# Altium project Tester.PrjPcb
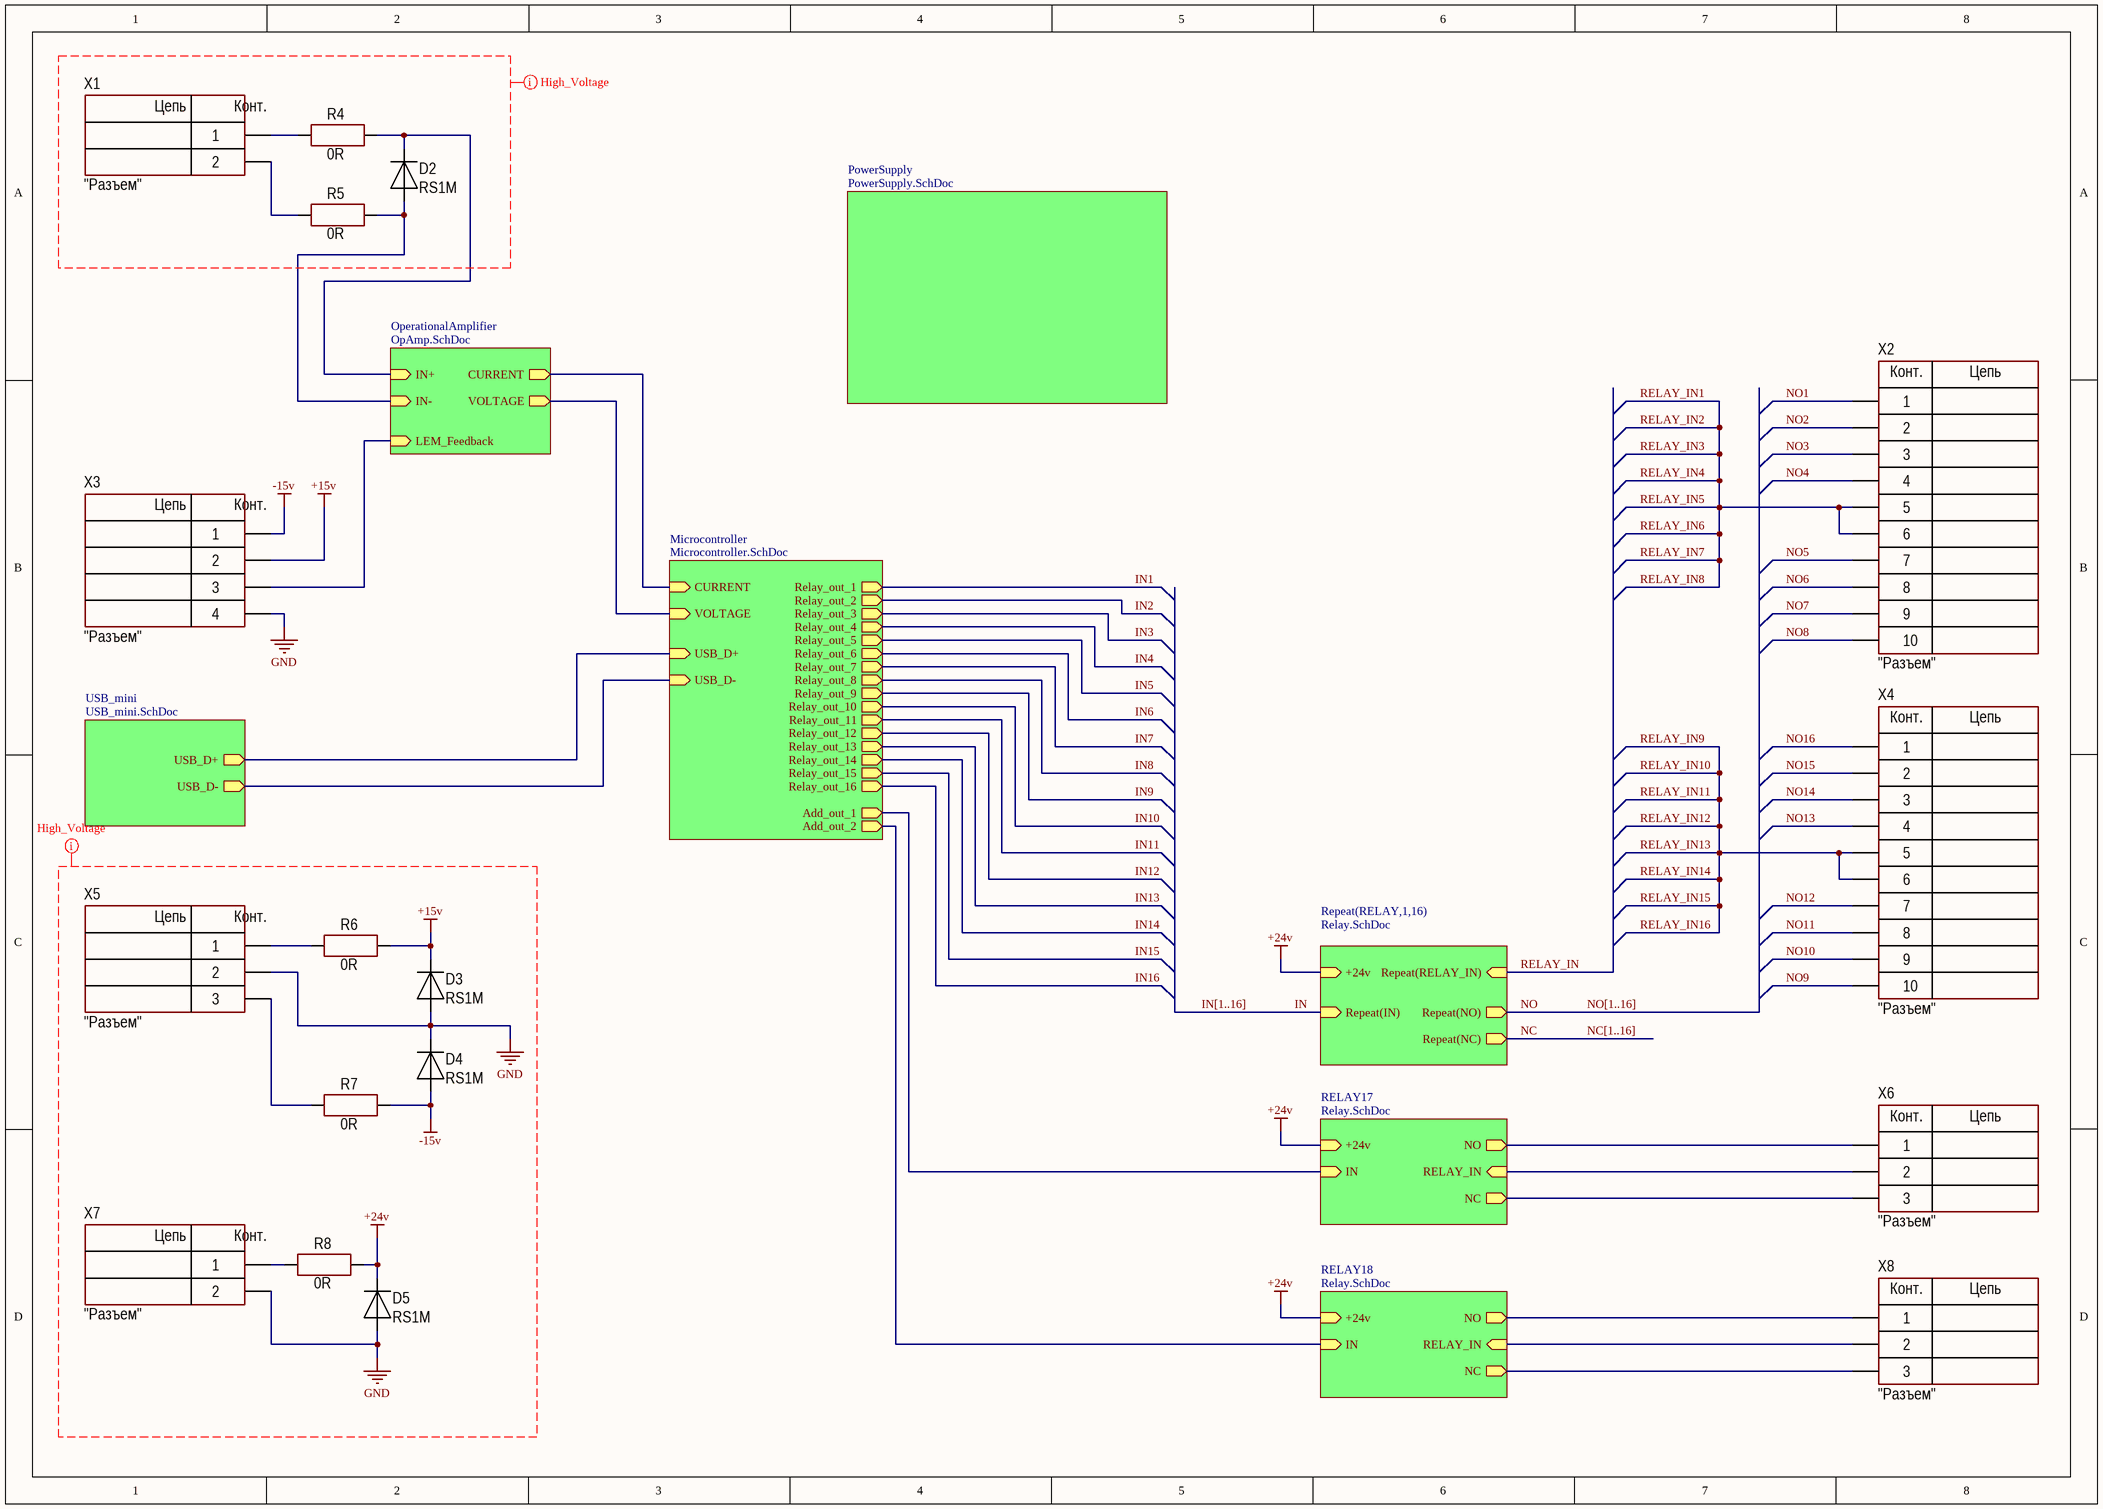
[diagram p0: Main.SchDoc]
6 sheets, 229 parts. Net scope: hierarchical (ports join the sheet entries above them; power ports are global).
Board file: PCB1.PcbDoc
Sheets:
  Main.SchDoc
    Microcontroller = Microcontroller.SchDoc
    USB_mini = USB_mini.SchDoc
    PowerSupply = PowerSupply.SchDoc
    OperationalAmplifier = OpAmp.SchDoc
    RELAY1 = Relay.SchDoc
    RELAY2 = Relay.SchDoc
    RELAY3 = Relay.SchDoc
    RELAY4 = Relay.SchDoc
    RELAY5 = Relay.SchDoc
    RELAY6 = Relay.SchDoc
    RELAY7 = Relay.SchDoc
    RELAY8 = Relay.SchDoc
    RELAY9 = Relay.SchDoc
    RELAY10 = Relay.SchDoc
    RELAY11 = Relay.SchDoc
    RELAY12 = Relay.SchDoc
    RELAY13 = Relay.SchDoc
    RELAY14 = Relay.SchDoc
    RELAY15 = Relay.SchDoc
    RELAY16 = Relay.SchDoc
    RELAY17 = Relay.SchDoc
    RELAY18 = Relay.SchDoc

## Sheet Main.SchDoc
size A3

### Parts
D2  PartNumber: RS1M  [DIODE: SMA]
D3  PartNumber: RS1M  [DIODE: SMA]
D4  PartNumber: RS1M  [DIODE: SMA]
D5  PartNumber: RS1M  [DIODE: SMA]
R4  value 0R  [RES: 1206]
R5  value 0R  [RES: 1206]
R6  value 0R  [RES: 1206]
R7  value 0R  [RES: 1206]
R8  value 0R  [RES: 1206]
X1  CommentText: "Разъем"  [300-021-12]
X2  CommentText: "Разъем"  [300-101-12]
X3  CommentText: "Разъем"  [300-041-12]
X4  CommentText: "Разъем"  [300-101-12]
X5  CommentText: "Разъем"  [300-031-12]
X6  CommentText: "Разъем"  [300-031-12]
X7  CommentText: "Разъем"  [300-021-12]
X8  CommentText: "Разъем"  [300-031-12]

### Sub-sheets
Microcontroller = Microcontroller.SchDoc: USB_D+ (in), USB_D- (in), VOLTAGE (in), CURRENT (in), Relay_out_10 (out), Relay_out_7 (out), Relay_out_14 (out), Relay_out_6 (out), Relay_out_3 (out), Relay_out_5 (out), Relay_out_11 (out), Relay_out_2 (out), Relay_out_12 (out), Relay_out_4 (out), Relay_out_1 (out), Relay_out_13 (out), Relay_out_8 (out), Relay_out_9 (out), Relay_out_16 (out), Relay_out_15 (out), Add_out_1 (out), Add_out_2 (out)
OperationalAmplifier = OpAmp.SchDoc: IN+ (in), LEM_Feedback (in), IN- (in), CURRENT (out), VOLTAGE (out)
PowerSupply = PowerSupply.SchDoc: no entries
RELAY17 = Relay.SchDoc: NC (out), IN (in), NO (out), RELAY_IN (in), +24v (in)
RELAY18 = Relay.SchDoc: +24v (in), NO (out), IN (in), RELAY_IN (in), NC (out)
Repeat(RELAY,1,16) = Relay.SchDoc: Repeat(IN) (in), +24v (in), Repeat(NO) (out), Repeat(RELAY_IN) (in), Repeat(NC) (out)
USB_mini = USB_mini.SchDoc: USB_D+ (out), USB_D- (out)

### Nets
+15v: D3.2 R6.1 X3.2
+24v: D5.2 R8.1 ; sheet Repeat(RELAY,1,16)/+24v, sheet RELAY17/+24v, sheet RELAY18/+24v
-15v: D4.1 R7.1 X3.1
GND: D3.1 D4.2 D5.1 X3.4 X5.2 X7.2
add_out1: sheet Microcontroller/Add_out_1, sheet RELAY17/IN
add_out2: sheet Microcontroller/Add_out_2, sheet RELAY18/IN
IN: sheet Repeat(RELAY,1,16)/Repeat(IN)
NC: sheet Repeat(RELAY,1,16)/Repeat(NC)
NO: sheet Repeat(RELAY,1,16)/Repeat(NO)
NO1: X2.1
NO2: X2.2
NO3: X2.3
NO4: X2.4
NO5: X2.7
NO6: X2.8
NO7: X2.9
NO8: X2.10
NO9: X4.10
NO10: X4.9
NO11: X4.8
NO12: X4.7
NO13: X4.4
NO14: X4.3
NO15: X4.2
NO16: X4.1
RELAY_IN: sheet Repeat(RELAY,1,16)/Repeat(RELAY_IN)
RELAY_IN1: X2.5 X2.6  [also labelled RELAY_IN2, RELAY_IN3, RELAY_IN4, RELAY_IN5, RELAY_IN6, RELAY_IN7, RELAY_IN8]
RELAY_IN10: X4.5 X4.6  [also labelled RELAY_IN11, RELAY_IN12, RELAY_IN13, RELAY_IN14, RELAY_IN15, RELAY_IN16, RELAY_IN9]
USB_D+: sheet Microcontroller/USB_D+, sheet USB_mini/USB_D+
USB_D-: sheet Microcontroller/USB_D-, sheet USB_mini/USB_D-
NetD2_1: D2.1 R5.1 ; sheet OperationalAmplifier/IN-
NetD2_2: D2.2 R4.1 ; sheet OperationalAmplifier/IN+
NetK1_RELAY17_3: X6.2 ; sheet RELAY17/RELAY_IN
NetK1_RELAY17_4: X6.3 ; sheet RELAY17/NC
NetK1_RELAY17_5: X6.1 ; sheet RELAY17/NO
NetK1_RELAY18_3: X8.2 ; sheet RELAY18/RELAY_IN
NetK1_RELAY18_4: X8.3 ; sheet RELAY18/NC
NetK1_RELAY18_5: X8.1 ; sheet RELAY18/NO
NetR4_2: R4.2 X1.1
NetR5_2: R5.2 X1.2
NetR6_2: R6.2 X5.1
NetR7_2: R7.2 X5.3
NetR8_2: R8.2 X7.1
NetR18_2: sheet Microcontroller/CURRENT, sheet OperationalAmplifier/CURRENT
NetR19_2: sheet Microcontroller/VOLTAGE, sheet OperationalAmplifier/VOLTAGE
NetR41_1: X3.3 ; sheet OperationalAmplifier/LEM_Feedback

### Buses and harness runs
bus IN[1..16]
bus NC[1..16]
bus NO[1..16]

### Layout directives
net class Hi_Voltage: (no net found under the mark), +15v, +24v, -15v, GND

### Notes on the sheet
- (in symbol Connector_terminal_2pin) Цепь; Конт.
- (in symbol PLS-2) Цепь; Конт.
- (in symbol PLS-3) Цепь; Конт.
- (in symbol PLS-4) Цепь; Конт.
- (in symbol PLS-10) Конт.; Цепь

### Library data of the parts
D2-D5 = Diode_single: Manufacturer: DIODES; ValueManufacturerPartNumber: RS1M, SMA; TypeDiode: Single diode; Voltage: 1000V; Current: 1A; VoltageDrop: 1V; RecoveryTime: 4ns; Package: SMA; HelpURL: https://www.digikey.com/product-detail/en/micro-commercial-co/1N4148WX-TP/1N4148WXTPMSCT-ND/717312; Temperature: -55...+150°C
R4-R8 = Resistor_1206: Manufacturer: Yageo; PartNumber: RC1206JR-07100RL; ValueManufacturerPartNumber: Resistor film, 0R, ±5%, 1206, 0.25W, -55...+125°C; TypeResistor: Resistor film; Power: 0.25W; Tolerance: ±5%; Package: 1206; HelpURL: https://www.digikey.com/product-detail/en/yageo/RC1206JR-07100RL/311-100ERCT-ND/732153; Temperature: -55...+125°C
X1 = Connector_terminal_2pin: Manufacturer: Degson; ValueManufacturerPartNumber: Terminal connector, 2pin, 3.5mm, 300VAC, 10A; PartNumber: DG350-3.5-02P-14; TypeConnector: Terminal connector; VoltageMax: 300VAC; Pitch: 3.5mm; CurrentMax: 10A; Multichannel: 2pin; HelpURL: https://www.chipdip.ru/product/dg350-3.5-02p-12
X2 X4 = PLS-10: Manufacturer: Connfly; ValueManufacturerPartNumber: Connector, 10pin, 2.54mm, 500VAC, 3A; TypeConnector: Connector; VoltageMax: 500VAC; Pitch: 2.54mm; CurrentMax: 3A; Multichannel: 10pin; HelpURL: https://www.chipdip.ru/product/pls-10; PartNumber: PLS-10
X3 = PLS-4: Manufacturer: Connfly; ValueManufacturerPartNumber: Connector, 4pin, 2.54mm, 500VAC, 3A; TypeConnector: Connector; VoltageMax: 500VAC; Pitch: 2.54mm; CurrentMax: 3A; Multichannel: 4pin; HelpURL: https://www.chipdip.ru/product/pls-4; PartNumber: PLS-4
X5 X6 X8 = PLS-3: Manufacturer: Connfly; ValueManufacturerPartNumber: Connector, 3pin, 2.54mm, 500VAC, 3A; TypeConnector: Connector; VoltageMax: 500VAC; Pitch: 2.54mm; CurrentMax: 3A; Multichannel: 3pin; HelpURL: https://www.chipdip.ru/product/pls-3; PartNumber: PLS-3
X7 = PLS-2: Manufacturer: Connfly; ValueManufacturerPartNumber: Connector, 2pin, 2.54mm, 500VAC, 3A; TypeConnector: Connector; VoltageMax: 500VAC; Pitch: 2.54mm; CurrentMax: 3A; Multichannel: 2pin; HelpURL: https://www.chipdip.ru/product/pls-2; PartNumber: PLS-2

## Sheet Microcontroller.SchDoc
size A3; Organization: Altium Limited; Address1: L3, 12a Rodborough Rd; Address2: Frenchs Forest; Address3: NSW; Address4: Australia 2086
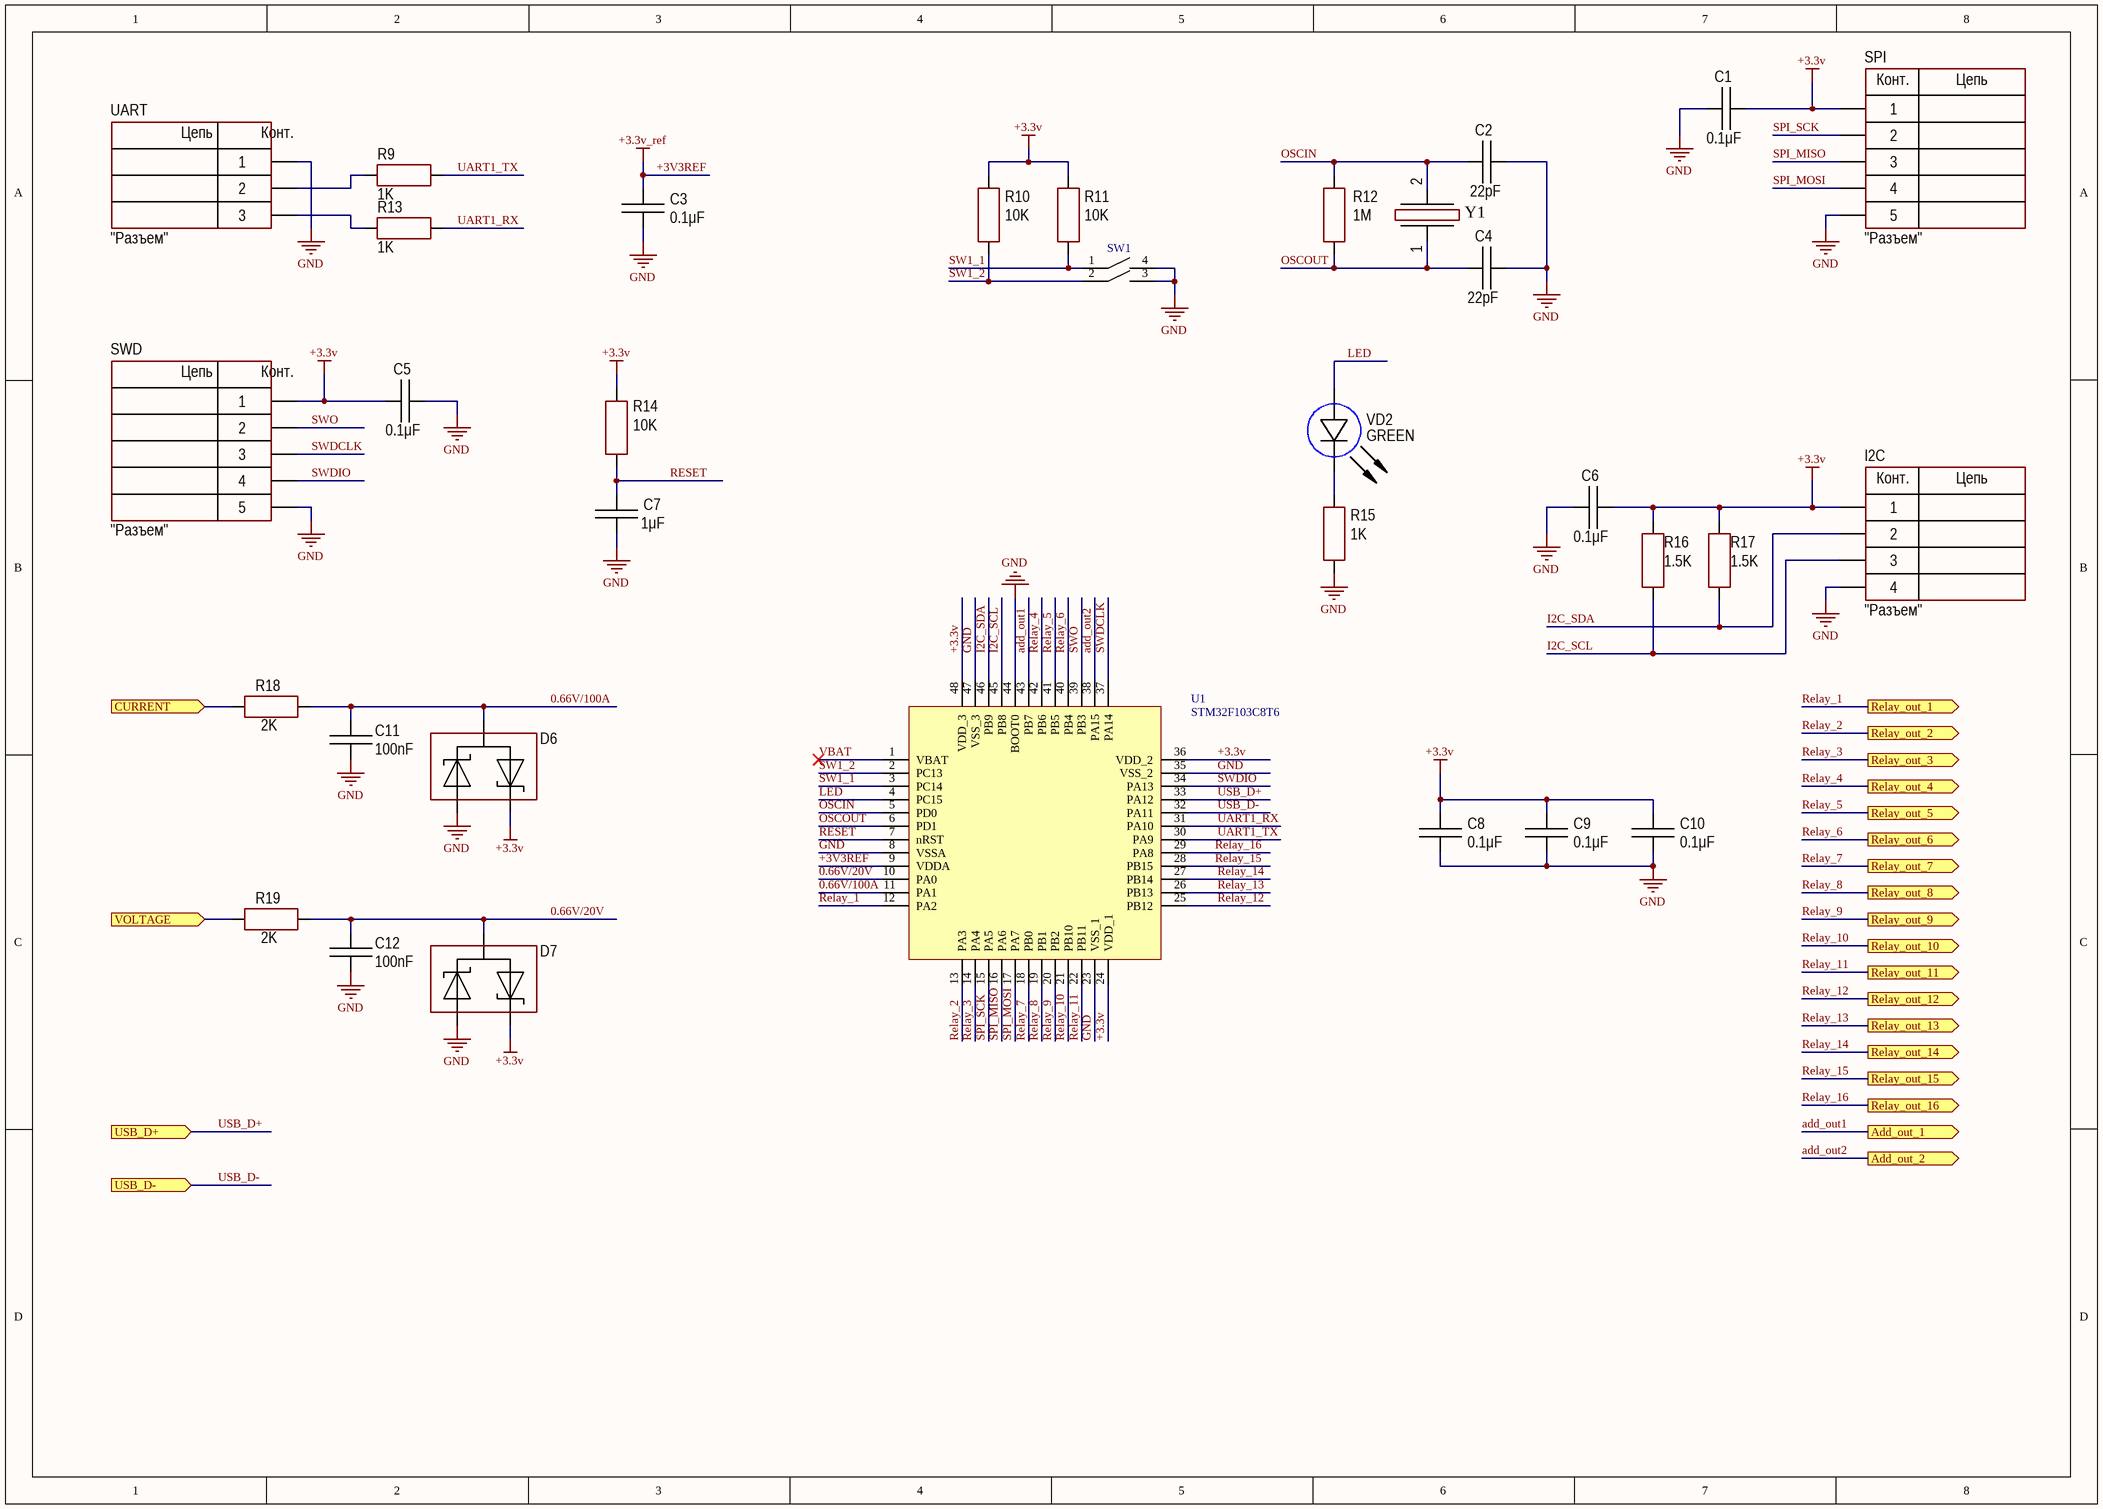
[diagram p1: Microcontroller.SchDoc]

### Parts
C1  value 0.1μF  [CAP: 1206]
C2  value 22pF  [CAP: 1206]
C3  value 0.1μF  [CAP: 1206]
C4  value 22pF  [CAP: 1206]
C5  value 0.1μF  [CAP: 1206]
C6  value 0.1μF  [CAP: 1206]
C7  value 1μF  [CAP: 1206]
C8  value 0.1μF  [CAP: 1206]
C9  value 0.1μF  [CAP: 1206]
C10  value 0.1μF  [CAP: 1206]
C11  value 100nF  [CAP: 1206]
C12  value 100nF  [CAP: 1206]
D6  (no value)  [SOT23]
D7  (no value)  [SOT23]
I2C  CommentText: "Разъем"  [CON: PLS-4]
R9  value 1K  [RES: 1206]
R10  value 10K  [RES: 1206]
R11  value 10K  [RES: 1206]
R12  value 1M  [RES: 1206]
R13  value 1K  [RES: 1206]
R14  value 10K  [RES: 1206]
R15  value 1K  [RES: 1206]
R16  value 1.5K  [RES: 1206]
R17  value 1.5K  [RES: 1206]
R18  value 2K  [RES: 1206]
R19  value 2K  [RES: 1206]
SPI  CommentText: "Разъем"  [CON: PLS-5]
SW1  (no value)  [DPL-2]
SWD  CommentText: "Разъем"  [CON: PLS-5]
U1  STM32F103C8T6  [48-LQFP]
UART  CommentText: "Разъем"  [CON: PLS-3]
VD2  Color: GREEN  [LED: 1206G]
Y1  (no value)  [HC49SM]

### Ports
Add_out_1 (out), Add_out_2 (out), CURRENT (in), Relay_out_1 (out), Relay_out_2 (out), Relay_out_3 (out), Relay_out_4 (out), Relay_out_5 (out), Relay_out_6 (out), Relay_out_7 (out), Relay_out_8 (out), Relay_out_9 (out), Relay_out_10 (out), Relay_out_11 (out), Relay_out_12 (out), Relay_out_13 (out), Relay_out_14 (out), Relay_out_15 (out), Relay_out_16 (out), USB_D+ (in), USB_D- (in), VOLTAGE (in)

### Nets
+3.3v: C1.2 C5.1 C6.2 C8.2 C9.2 C10.2 D6.2 D7.2 I2C.1 R10.2 R11.2 R14.2 R16.1 R17.1 SPI.1 SWD.1 U1.24(VDD_1) U1.36(VDD_2) U1.48(VDD_3)
+3V3REF: C3.2 U1.9(VDDA)  [also labelled +3.3v_ref]
GND: C1.1 C2.1 C3.1 C4.1 C5.2 C6.1 C7.1 C8.1 C9.1 C10.1 C11.1 C12.1 D6.1 D7.1 I2C.4 R15.1 SPI.5 SW1.3 SW1.4 SWD.5 U1.8(VSSA) U1.23(VSS_1) U1.35(VSS_2) U1.44(BOOT0) U1.47(VSS_3) UART.1
0.66V/20V: C12.2 D7.3 R19.1 U1.10(PA0)
0.66V/100A: C11.2 D6.3 R18.1 U1.11(PA1)
add_out1: U1.43(PB7) ; port Add_out_1
add_out2: U1.38(PA15) ; port Add_out_2
I2C_SCL: I2C.3 R16.2 U1.45(PB8)
I2C_SDA: I2C.2 R17.2 U1.46(PB9)
LED: U1.4(PC15) VD2.1(A)
OSCIN: C2.2 R12.2 U1.5(PD0) Y1.2
OSCOUT: C4.2 R12.1 U1.6(PD1) Y1.1
Relay_1: U1.12(PA2) ; port Relay_out_1  [project net IN1]
Relay_2: U1.13(PA3) ; port Relay_out_2  [project net IN2]
Relay_3: U1.14(PA4) ; port Relay_out_3  [project net IN3]
Relay_4: U1.42(PB6) ; port Relay_out_4  [project net IN4]
Relay_5: U1.41(PB5) ; port Relay_out_5  [project net IN5]
Relay_6: U1.40(PB4) ; port Relay_out_6  [project net IN6]
Relay_7: U1.18(PB0) ; port Relay_out_7  [project net IN7]
Relay_8: U1.19(PB1) ; port Relay_out_8  [project net IN8]
Relay_9: U1.20(PB2) ; port Relay_out_9  [project net IN9]
Relay_10: U1.21(PB10) ; port Relay_out_10  [project net IN10]
Relay_11: U1.22(PB11) ; port Relay_out_11  [project net IN11]
Relay_12: U1.25(PB12) ; port Relay_out_12  [project net IN12]
Relay_13: U1.26(PB13) ; port Relay_out_13  [project net IN13]
Relay_14: U1.27(PB14) ; port Relay_out_14  [project net IN14]
Relay_15: U1.28(PB15) ; port Relay_out_15  [project net IN15]
Relay_16: U1.29(PA8) ; port Relay_out_16  [project net IN16]
RESET: C7.2 R14.1 U1.7(nRST)
SPI_MISO: SPI.3 U1.16(PA6)
SPI_MOSI: SPI.4 U1.17(PA7)
SPI_SCK: SPI.2 U1.15(PA5)
SW1_1: R11.1 SW1.1 U1.3(PC14)
SW1_2: R10.1 SW1.2 U1.2(PC13)
SWDCLK: SWD.3 U1.37(PA14)
SWDIO: SWD.4 U1.34(PA13)
SWO: SWD.2 U1.39(PB3)
UART1_RX: R13.1 U1.31(PA10)
UART1_TX: R9.1 U1.30(PA9)
USB_D+: U1.33(PA12) ; port USB_D+
USB_D-: U1.32(PA11) ; port USB_D-
VBAT: U1.1(VBAT)
NetR9_2: R9.2 UART.2
NetR13_2: R13.2 UART.3
NetR15_2: R15.2 VD2.2(C)
NetR18_2: R18.2 ; port CURRENT
NetR19_2: R19.2 ; port VOLTAGE

### Notes on the sheet
- Title
- Size:
- Date:
- File:
- A0
- Number:
- Time:
- Revision:
- Sheet
- of
- (in symbol PLS-3) Цепь; Конт.
- (in symbol PLS-4) Конт.; Цепь
- (in symbol PLS-5) Цепь; Конт.

### Library data of the parts
C1 C3 C5 C6 C8-C10 = Ceramic_1206: Manufacturer: Yageo; PartNumber: CC1206KRX7R9BB104; ValueManufacturerPartNumber: Ceramic capacitor, 0.1μF, X7R, ±10%, 50V, 1206, -55...+125°C; TypeCapacitor: Ceramic capacitor; Tolerance: ±10%; TypeDielectric: X7R; Voltage: 50V; Package: 1206; HelpURL: https://www.digikey.com/product-detail/en/yageo/CC1206KRX7R9BB104/311-1179-1-ND/303089; Temperature: -55...+125°C
C2 C4 = Ceramic_1206: Manufacturer: Yageo; PartNumber: CC1206KRX7R9BB104; ValueManufacturerPartNumber: Ceramic capacitor, 22pF, X7R, ±10%, 50V, 1206, -55...+125°C; TypeCapacitor: Ceramic capacitor; Tolerance: ±10%; TypeDielectric: X7R; Voltage: 50V; Package: 1206; HelpURL: https://www.digikey.com/product-detail/en/yageo/CC1206KRX7R9BB104/311-1179-1-ND/303089; Temperature: -55...+125°C
C7 = Ceramic_1206: Manufacturer: Yageo; PartNumber: CC1206KRX7R9BB104; ValueManufacturerPartNumber: Ceramic capacitor, 1μF, X7R, ±10%, 50V, 1206, -55...+125°C; TypeCapacitor: Ceramic capacitor; Tolerance: ±10%; TypeDielectric: X7R; Voltage: 50V; Package: 1206; HelpURL: https://www.digikey.com/product-detail/en/yageo/CC1206KRX7R9BB104/311-1179-1-ND/303089; Temperature: -55...+125°C
C11 C12 = Ceramic_1206: Manufacturer: Yageo; PartNumber: CC1206KRX7R9BB104; ValueManufacturerPartNumber: Ceramic capacitor, 100nF, X7R, ±10%, 50V, 1206, -55...+125°C; TypeCapacitor: Ceramic capacitor; Tolerance: ±10%; TypeDielectric: X7R; Voltage: 50V; Package: 1206; HelpURL: https://www.digikey.com/product-detail/en/yageo/CC1206KRX7R9BB104/311-1179-1-ND/303089; Temperature: -55...+125°C
D6 D7 = Schottky_array: Manufacturer: Diodes Incorporated; ValueManufacturerPartNumber: BAS40-04, SOT23-3; PartNumber: BAS40-04; TypeDiode: Schottky array; Voltage: 40V; Current: 120mA; VoltageDrop: 1V; RecoveryTime: 15pF; Package: SOT23-3; HelpURL: https://www.digikey.com/product-detail/en/diodes-incorporated/MBR0580S1-7/MBR0580S1-7DICT-ND/5080371; Temperature: -55...+150°C
I2C = PLS-4: as X3 on sheet Main; HelpURL: https://www.chipdip.ru/product/pls-4; PartNumber: PLS-4
R9 R13 R15 = Resistor_1206: Manufacturer: Yageo; PartNumber: RC1206JR-07100RL; ValueManufacturerPartNumber: Resistor film, 1K, ±5%, 1206, 0.25W, -55...+125°C; TypeResistor: Resistor film; Power: 0.25W; Tolerance: ±5%; Package: 1206; HelpURL: https://www.digikey.com/product-detail/en/yageo/RC1206JR-07100RL/311-100ERCT-ND/732153; Temperature: -55...+125°C
R10 R11 = Resistor_1206: Manufacturer: Yageo; PartNumber: RC1206JR-07100RL; ValueManufacturerPartNumber: Resistor, 10K, 1206; Power: 0.25W; Tolerance: ±5%; Package: 1206; HelpURL: https://www.digikey.com/product-detail/en/yageo/RC1206JR-07100RL/311-100ERCT-ND/732153; Temperature: -55...+125°C; TypeResistor: Resistor
R12 = Resistor_1206: Manufacturer: Yageo; PartNumber: RC1206JR-07100RL; ValueManufacturerPartNumber: Resistor film, 1M, ±5%, 1206, 0.25W, -55...+125°C; TypeResistor: Resistor film; Power: 0.25W; Tolerance: ±5%; Package: 1206; HelpURL: https://www.digikey.com/product-detail/en/yageo/RC1206JR-07100RL/311-100ERCT-ND/732153; Temperature: -55...+125°C
R14 = Resistor_1206: Manufacturer: Yageo; PartNumber: RC1206JR-07100RL; ValueManufacturerPartNumber: Resistor film, 10K, ±5%, 1206, 0.25W, -55...+125°C; TypeResistor: Resistor film; Power: 0.25W; Tolerance: ±5%; Package: 1206; HelpURL: https://www.digikey.com/product-detail/en/yageo/RC1206JR-07100RL/311-100ERCT-ND/732153; Temperature: -55...+125°C
R16 R17 = Resistor_1206: Manufacturer: Yageo; PartNumber: RC1206JR-07100RL; ValueManufacturerPartNumber: Resistor film, 1.5K, ±5%, 1206, 0.25W, -55...+125°C; TypeResistor: Resistor film; Power: 0.25W; Tolerance: ±5%; Package: 1206; HelpURL: https://www.digikey.com/product-detail/en/yageo/RC1206JR-07100RL/311-100ERCT-ND/732153; Temperature: -55...+125°C
R18 R19 = Resistor_1206: Manufacturer: Yageo; PartNumber: RC1206JR-07100RL; ValueManufacturerPartNumber: Resistor film, 2K, ±5%, 1206, 0.25W, -55...+125°C; TypeResistor: Resistor film; Power: 0.25W; Tolerance: ±5%; Package: 1206; HelpURL: https://www.digikey.com/product-detail/en/yageo/RC1206JR-07100RL/311-100ERCT-ND/732153; Temperature: -55...+125°C
SPI SWD = PLS-5: Manufacturer: Connfly; ValueManufacturerPartNumber: Connector, 5pin, 2.54mm, 500VAC, 3A; TypeConnector: Connector; VoltageMax: 500VAC; Pitch: 2.54mm; CurrentMax: 3A; Multichannel: 5pin; HelpURL: https://www.chipdip.ru/product/pls-5; PartNumber: PLS-5
SW1 = NDP-02: ValueManufacturerPartNumber: NDP-02, DPL-02; Package: DPL-02; PartNumber: NDP-02
UART = PLS-3: as X5 on sheet Main; HelpURL: https://www.chipdip.ru/product/pls-3; PartNumber: PLS-3
VD2 = LED_single: ValueManufacturerPartNumber: LED, Green, *, *, *, -55...+150°C; TypeDiode: LED; Manufacturer: *; Package: *; HelpURL: *; Temperature: -55...+150°C; Current: *; VoltageDrop: *; PartNumber: *; ColorParameter: Green
Y1 = HC49SM: PartNumber: HC49SM-16.000MHZ-20PF; ValueManufacturerPartNumber: HC49SM-16.000MHZ-20PF, HC49SM; Package: HC49SM

## Sheet USB_mini.SchDoc
size A4; Organization: Altium Limited; Address1: L3, 12a Rodborough Rd; Address2: Frenchs Forest; Address3: NSW; Address4: Australia 2086
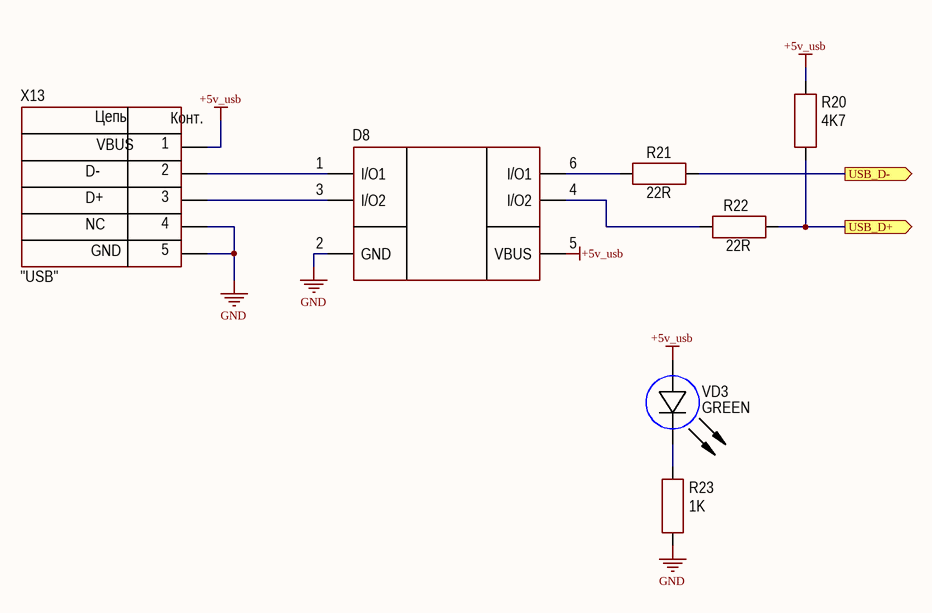
[diagram p2: USB_mini.SchDoc]

### Parts
D8  (no value)  [SOT23-6]
R20  value 4K7  [RES: 1206]
R21  value 22R  [RES: 1206]
R22  value 22R  [RES: 1206]
R23  value 1K  [RES: 1206]
VD3  Color: GREEN  [LED: 1206G]
X13  CommentText: "USB"  [CON: 0675031020]

### Ports
USB_D+ (out), USB_D- (out)

### Nets
+5v_usb: D8.5(VBUS) R20.1 VD3.1(A) X13.1
GND: D8.2(GND) R23.1 X13.4 X13.5
USB_D+: R20.2 R22.2 ; port USB_D+
USB_D-: R21.2 ; port USB_D-
NetD8_1: D8.1(I/O1) X13.2
NetD8_3: D8.3(I/O2) X13.3
NetD8_4: D8.4(I/O2) R22.1
NetD8_6: D8.6(I/O1) R21.1
NetR23_2: R23.2 VD3.2(C)

### Notes on the sheet
- Title
- Size:
- Date:
- File:
- A0
- Number:
- Time:
- Revision:
- Sheet
- of
- (in symbol Connector_USB_mini_B) Цепь; Конт.; VBUS; D-; D+; NC; GND

### Library data of the parts
D8 = USBLC6-2SC6: Manufacturer: STMicroelectronics; TypeDiode: USB protection; Current: 5A peak; VoltageDrop: 17V; RecoveryTime: Power line; Package: SOT-23-6; HelpURL: https://www.digikey.com/product-detail/en/stmicroelectronics/USBLC6-2SC6/497-5235-1-ND/1121688; ValueManufacturerPartNumber: =TypeDiode+', '+Voltage+', '+Current+', '+VoltageDrop+', '+RecoveryTime+', '+Package+', '+Temperature; Temperature: -40...+125°C; PartNumber: USBLC6-2SC6
R20 = Resistor_1206: Manufacturer: Yageo; PartNumber: RC1206JR-07100RL; ValueManufacturerPartNumber: Resistor film, 4K7, ±5%, 1206, 0.25W, -55...+125°C; TypeResistor: Resistor film; Power: 0.25W; Tolerance: ±5%; Package: 1206; HelpURL: https://www.digikey.com/product-detail/en/yageo/RC1206JR-07100RL/311-100ERCT-ND/732153; Temperature: -55...+125°C
R21 R22 = Resistor_1206: Manufacturer: Yageo; PartNumber: RC1206JR-07100RL; ValueManufacturerPartNumber: Resistor film, 22R, ±5%, 1206, 0.25W, -55...+125°C; TypeResistor: Resistor film; Power: 0.25W; Tolerance: ±5%; Package: 1206; HelpURL: https://www.digikey.com/product-detail/en/yageo/RC1206JR-07100RL/311-100ERCT-ND/732153; Temperature: -55...+125°C
R23 = Resistor_1206: as R9 on sheet Microcontroller; Package: 1206; HelpURL: https://www.digikey.com/product-detail/en/yageo/RC1206JR-07100RL/311-100ERCT-ND/732153; Temperature: -55...+125°C
VD3 = LED_single: as VD2 on sheet Microcontroller; Manufacturer: *; Package: *; HelpURL: *; Temperature: -55...+150°C; Current: *; VoltageDrop: *; PartNumber: *; ColorParameter: Green
X13 = Connector_USB_mini_B: Manufacturer: Molex; ValueManufacturerPartNumber: USB mini B; PartNumber: 0675031020; HelpURL: https://www.digikey.com/product-detail/en/molex/0675031020/WM5461CT-ND/1624427; TypeConnector: USB mini B

## Sheet PowerSupply.SchDoc
size A4; Organization: Altium Limited; Address1: L3, 12a Rodborough Rd; Address2: Frenchs Forest; Address3: NSW; Address4: Australia 2086
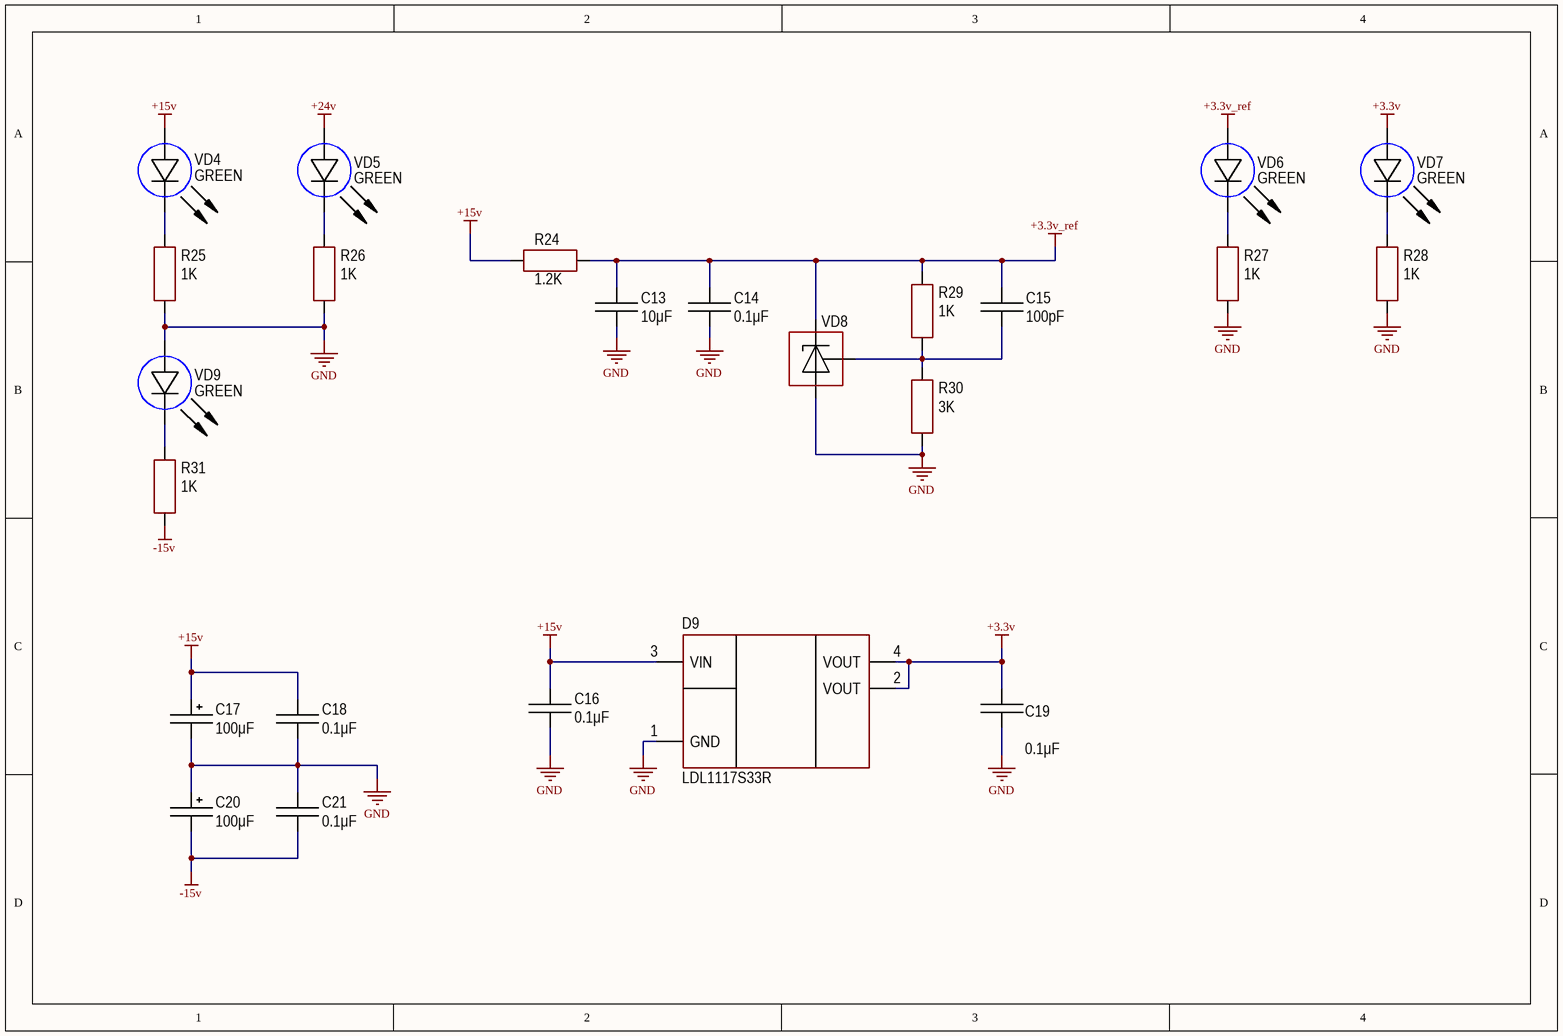
[diagram p3: PowerSupply.SchDoc]

### Parts
C13  value 10μF  [CAP: 1206]
C14  value 0.1μF  [CAP: 1206]
C15  value 100pF  [CAP: 1206]
C16  value 0.1μF  [CAP: 1206]
C17  value 100μF  [CAPAE7466X80L]
C18  value 0.1μF  [CAP: 1206]
C19  value 0.1μF  [CAP: 1206]
C20  value 100μF  [CAPAE7466X80L]
C21  value 0.1μF  [CAP: 1206]
D9  (no value)  [SOT223]
R24  value 1.2K  [RES: 1206]
R25  value 1K  [RES: 1206]
R26  value 1K  [RES: 1206]
R27  value 1K  [RES: 1206]
R28  value 1K  [RES: 1206]
R29  value 1K  [RES: 1206]
R30  value 3K  [RES: 1206]
R31  value 1K  [RES: 1206]
VD4  Color: GREEN  [LED: 1206G]
VD5  Color: GREEN  [LED: 1206G]
VD6  Color: GREEN  [LED: 1206G]
VD7  Color: GREEN  [LED: 1206G]
VD8  (no value)  [SOT23]
VD9  Color: GREEN  [LED: 1206G]

### Nets
+3.3v: C19.2 D9.2(VOUT) D9.4(VOUT) VD7.1(A)
+3.3v_ref: C13.1 C14.1 C15.1 R24.1 R29.2 VD6.1(A) VD8.1  [project net +3V3REF]
+15v: C16.2 C17.1 C18.2 D9.3(VIN) R24.2 VD4.1(A)
+24v: VD5.1(A)
-15v: C20.2 C21.1 R31.2
GND: C13.2 C14.2 C16.1 C17.2 C18.1 C19.1 C20.1 C21.2 D9.1(GND) R25.1 R26.1 R27.1 R28.1 R30.1 VD8.3 VD9.1(A)
NetC15_2: C15.2 R29.1 R30.2 VD8.2
NetR25_2: R25.2 VD4.2(C)
NetR26_2: R26.2 VD5.2(C)
NetR27_2: R27.2 VD6.2(C)
NetR28_2: R28.2 VD7.2(C)
NetR31_1: R31.1 VD9.2(C)

### Notes on the sheet
- Title
- Size:
- Date:
- File:
- A0
- Number:
- Time:
- Revision:
- Sheet
- of

### Library data of the parts
C13 = Ceramic_1206: Manufacturer: Yageo; PartNumber: CC1206KRX7R9BB104; ValueManufacturerPartNumber: Ceramic capacitor, 10μF, X7R, ±10%, 50V, 1206, -55...+125°C; TypeCapacitor: Ceramic capacitor; Tolerance: ±10%; TypeDielectric: X7R; Voltage: 50V; Package: 1206; HelpURL: https://www.digikey.com/product-detail/en/yageo/CC1206KRX7R9BB104/311-1179-1-ND/303089; Temperature: -55...+125°C
C14 C16 C18 C19 C21 = Ceramic_1206: as C1 on sheet Microcontroller; Package: 1206; HelpURL: https://www.digikey.com/product-detail/en/yageo/CC1206KRX7R9BB104/311-1179-1-ND/303089; Temperature: -55...+125°C
C15 = Ceramic_1206: Manufacturer: Yageo; PartNumber: CC1206KRX7R9BB104; ValueManufacturerPartNumber: Ceramic capacitor, 100pF, X7R, ±10%, 50V, 1206, -55...+125°C; TypeCapacitor: Ceramic capacitor; Tolerance: ±10%; TypeDielectric: X7R; Voltage: 50V; Package: 1206; HelpURL: https://www.digikey.com/product-detail/en/yageo/CC1206KRX7R9BB104/311-1179-1-ND/303089; Temperature: -55...+125°C
C17 C20 = Aluminium: Manufacturer: Wurth; PartNumber: EEEFK1V101XP; ValueManufacturerPartNumber: EEEFK1V101XP, 100μF, 35V, D8; TypeCapacitor: Aluminium capacitor; Tolerance: ±20%; Impedance: 54mOhm; Voltage: 35V; Package: D8; HelpURL: https://www.digikey.com/product-detail/en/wurth-electronics-inc/860080475013/732-9029-1-ND/5728972; Temperature: -55...+105°C
D9 = LDL1117S33R: Linear voltage regulator; Manufacturer: STMicroelectronics; ValueManufacturerPartNumber: Linear voltage regulator, input 3.9...18V, 0.6V, output 3.3V, 1.2A, -40...+85°C, SOT223; VoltageInput: input 3.9...18V; MaxDropout: 0.6V; CurrentOutput: 1.2A; VoltageOutput: output 3.3V; HelpURL: https://www.digikey.com/product-detail/en/stmicroelectronics/LDL1117S33R/497-17239-1-ND/7102079; Package: SOT223; ComponentType: Linear voltage regulator; Temperature: -40...+85°C; PartNumber: LDL1117S33R
R24 = Resistor_1206: Manufacturer: Yageo; PartNumber: RC1206JR-07100RL; ValueManufacturerPartNumber: Resistor film, 1.2K, ±5%, 1206, 0.25W, -55...+125°C; TypeResistor: Resistor film; Power: 0.25W; Tolerance: ±5%; Package: 1206; HelpURL: https://www.digikey.com/product-detail/en/yageo/RC1206JR-07100RL/311-100ERCT-ND/732153; Temperature: -55...+125°C
R25-R29 R31 = Resistor_1206: as R9 on sheet Microcontroller; Package: 1206; HelpURL: https://www.digikey.com/product-detail/en/yageo/RC1206JR-07100RL/311-100ERCT-ND/732153; Temperature: -55...+125°C
R30 = Resistor_1206: Manufacturer: Yageo; PartNumber: RC1206JR-07100RL; ValueManufacturerPartNumber: Resistor film, 3K, ±5%, 1206, 0.25W, -55...+125°C; TypeResistor: Resistor film; Power: 0.25W; Tolerance: ±5%; Package: 1206; HelpURL: https://www.digikey.com/product-detail/en/yageo/RC1206JR-07100RL/311-100ERCT-ND/732153; Temperature: -55...+125°C
VD4-VD7 VD9 = LED_single: as VD2 on sheet Microcontroller; Manufacturer: *; Package: *; HelpURL: *; Temperature: -55...+150°C; Current: *; VoltageDrop: *; PartNumber: *; ColorParameter: Green
VD8 = Zener_program: Manufacturer: Texas Instruments; ValueManufacturerPartNumber: Program zener diode, 36V, 100mA, 2.495V, ±1%, SOT-23, 0...+70°C; PartNumber: TL431; TypeDiode: Program zener diode; Current: 100mA; VoltageDrop: 2.495V; Tolerance: ±1%; Voltage: 36V; Package: SOT-23; HelpURL: https://www.digikey.com/product-detail/en/texas-instruments/TL431ACDBZR/296-17328-1-ND/686884; Temperature: 0...+70°C

## Sheet OpAmp.SchDoc
size A3; Organization: Altium Limited; Address1: L3, 12a Rodborough Rd; Address2: Frenchs Forest; Address3: NSW; Address4: Australia 2086
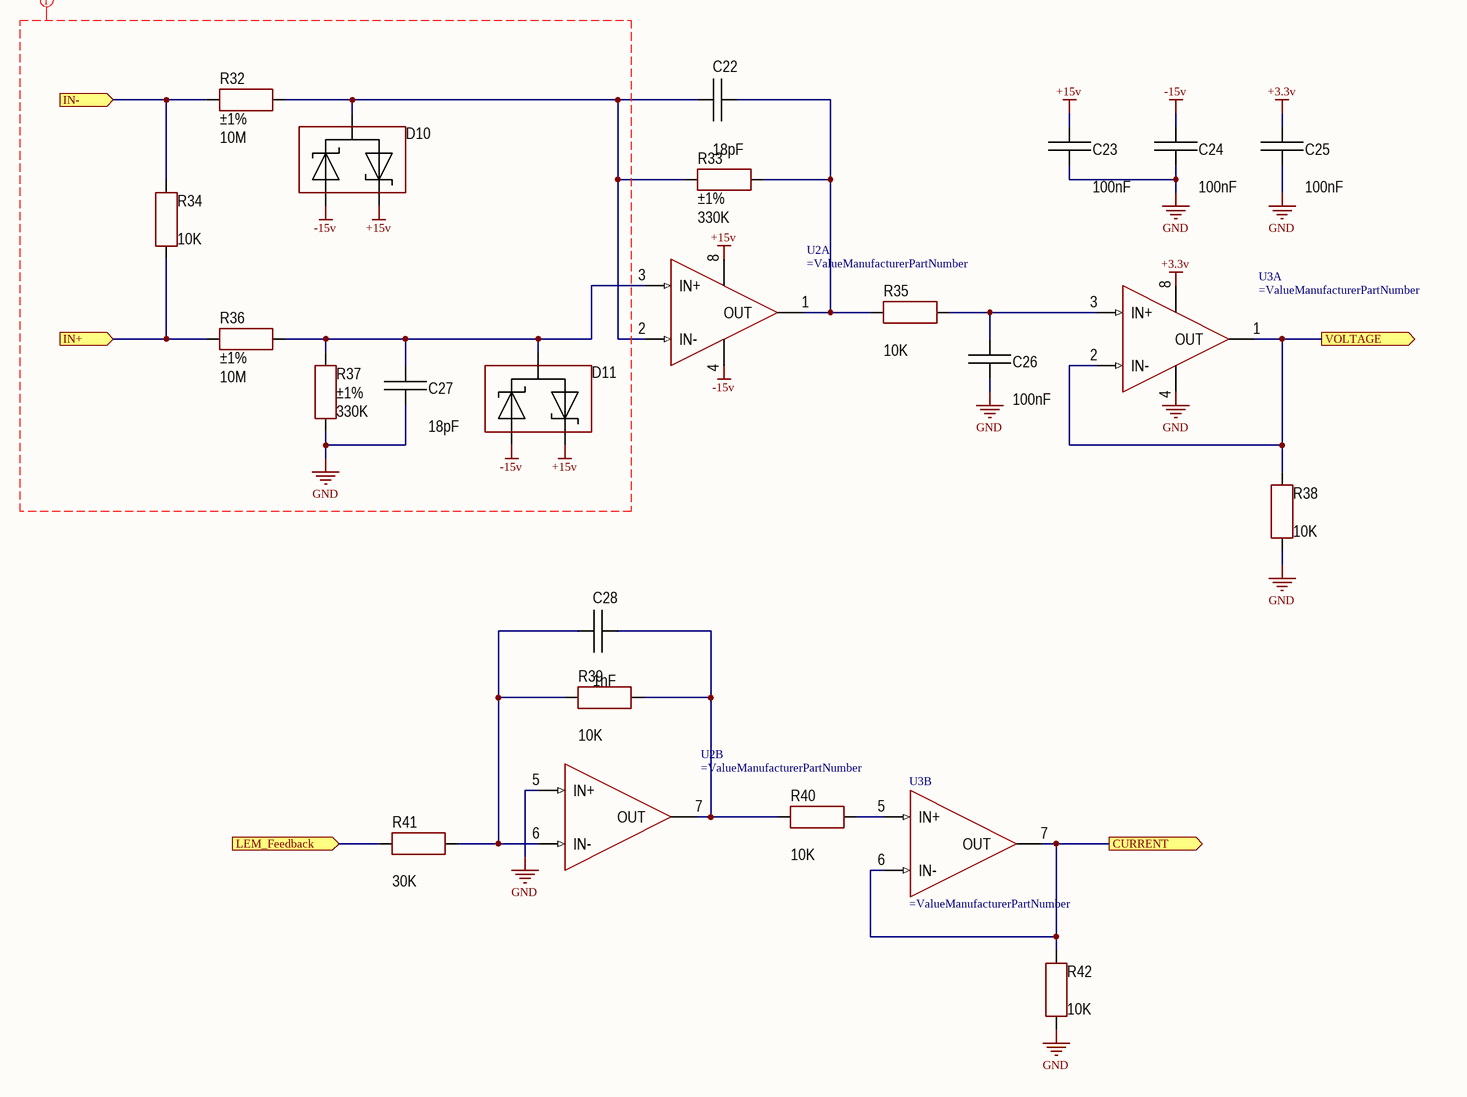
[diagram p4: OpAmp.SchDoc]

### Parts
C22  value 18pF  [CAP: 1206]
C23  value 100nF  [CAP: 1206]
C24  value 100nF  [CAP: 1206]
C25  value 100nF  [CAP: 1206]
C26  value 100nF  [CAP: 1206]
C27  value 18pF  [CAP: 1206]
C28  value 1nF  [CAP: 1206]
D10  (no value)  [SOT23]
D11  (no value)  [SOT23]
R32  value 10M  Tolerance: ±1%  [CFR-50]
R33  value 330K  Tolerance: ±1%  [RES: 1206]
R34  value 10K  [CPF-3]
R35  value 10K  [RES: 1206]
R36  value 10M  Tolerance: ±1%  [CFR-50]
R37  value 330K  Tolerance: ±1%  [RES: 1206]
R38  value 10K  [RES: 1206]
R39  value 10K  [RES: 1206]
R40  value 10K  [RES: 1206]
R41  value 30K  [RES: 1206]
R42  value 10K  [RES: 1206]
U2  (no value)  [8-SOIC]  (parts A,B of 2)
U3  (no value)  [8-SOIC]  (parts A,B of 2)

### Ports
CURRENT (out), IN+ (in), IN- (in), LEM_Feedback (in), VOLTAGE (out)

### Nets
+3.3v: C25.2 U3.8(V+)
+15v: C23.2 D10.2 D11.2 U2.8(V+)
-15v: C24.2 D10.1 D11.1 U2.4(V-)
GND: C23.1 C24.1 C25.1 C26.1 C27.1 R37.1 R38.1 R42.1 U2.5(IN+) U3.4(V-)
NetC22_1: C22.1 R33.2 R35.1 U2.1(OUT)
NetC22_2: C22.2 D10.3 R32.1 R33.1 U2.2(IN-)
NetC26_2: C26.2 R35.2 U3.3(IN+)
NetC27_2: C27.2 D11.3 R36.2 R37.2 U2.3(IN+)
NetC28_1: C28.1 R39.2 R40.1 U2.7(OUT)
NetC28_2: C28.2 R39.1 R41.2 U2.6(IN-)
NetD2_1: R32.2 R34.2 ; port IN-
NetD2_2: R34.1 R36.1 ; port IN+
NetR18_2: R42.2 U3.6(IN-) U3.7(OUT) ; port CURRENT
NetR19_2: R38.2 U3.1(OUT) U3.2(IN-) ; port VOLTAGE
NetR40_2: R40.2 U3.5(IN+)
NetR41_1: R41.1 ; port LEM_Feedback

### Layout directives
net class Hi_Voltage: +15v, -15v, GND

### Notes on the sheet
- Title
- Size:
- Date:
- File:
- A0
- Number:
- Time:
- Revision:
- Sheet
- of

### Library data of the parts
C22 C27 = Ceramic_1206: Manufacturer: Yageo; PartNumber: CC1206KRX7R9BB104; ValueManufacturerPartNumber: Ceramic capacitor, 18pF, 1206; TypeCapacitor: Ceramic capacitor; Tolerance: ±10%; TypeDielectric: X7R; Voltage: 50V; Package: 1206; HelpURL: https://www.digikey.com/product-detail/en/yageo/CC1206KRX7R9BB104/311-1179-1-ND/303089; Temperature: -55...+125°C
C23-C26 = Ceramic_1206: Manufacturer: Yageo; PartNumber: CC1206KRX7R9BB104; ValueManufacturerPartNumber: Ceramic capacitor, 100nF, 1206; TypeCapacitor: Ceramic capacitor; Tolerance: ±10%; TypeDielectric: X7R; Voltage: 50V; Package: 1206; HelpURL: https://www.digikey.com/product-detail/en/yageo/CC1206KRX7R9BB104/311-1179-1-ND/303089; Temperature: -55...+125°C
C28 = Ceramic_1206: Manufacturer: Yageo; PartNumber: CC1206KRX7R9BB104; ValueManufacturerPartNumber: Ceramic capacitor, 1nF, 1206; TypeCapacitor: Ceramic capacitor; Tolerance: ±10%; TypeDielectric: X7R; Voltage: 50V; Package: 1206; HelpURL: https://www.digikey.com/product-detail/en/yageo/CC1206KRX7R9BB104/311-1179-1-ND/303089; Temperature: -55...+125°C
D10 D11 = Schottky_array: as D6 on sheet Microcontroller; Package: SOT23-3; HelpURL: https://www.digikey.com/product-detail/en/diodes-incorporated/MBR0580S1-7/MBR0580S1-7DICT-ND/5080371; Temperature: -55...+150°C
R32 R36 = Resistor_1206: Manufacturer: Yageo; PartNumber: RC1206JR-07100RL; ValueManufacturerPartNumber: Resistor, 10M, CFR-50; Power: 0.25W; Package: CFR-50; HelpURL: https://www.digikey.com/product-detail/en/yageo/RC1206JR-07100RL/311-100ERCT-ND/732153; Temperature: -55...+125°C; TypeResistor: Resistor
R33 R37 = Resistor_1206: Manufacturer: Yageo; PartNumber: RC1206JR-07100RL; ValueManufacturerPartNumber: Resistor, 330K, 1206; Power: 0.25W; Package: 1206; HelpURL: https://www.digikey.com/product-detail/en/yageo/RC1206JR-07100RL/311-100ERCT-ND/732153; Temperature: -55...+125°C; TypeResistor: Resistor
R34 = Resistor_1206: Manufacturer: Yageo; PartNumber: RC1206JR-07100RL; ValueManufacturerPartNumber: Resistor, 10K, CPF-3; Power: 3W; Tolerance: ±5%; Package: CPF-3; HelpURL: https://www.digikey.com/product-detail/en/yageo/RC1206JR-07100RL/311-100ERCT-ND/732153; Temperature: -55...+125°C; TypeResistor: Resistor
R35 R38-R40 R42 = Resistor_1206: as R10 on sheet Microcontroller; Package: 1206; HelpURL: https://www.digikey.com/product-detail/en/yageo/RC1206JR-07100RL/311-100ERCT-ND/732153; Temperature: -55...+125°C; TypeResistor: Resistor
R41 = Resistor_1206: Manufacturer: Yageo; PartNumber: RC1206JR-07100RL; ValueManufacturerPartNumber: Resistor, 30K, 1206; Power: 0.25W; Tolerance: ±5%; Package: 1206; HelpURL: https://www.digikey.com/product-detail/en/yageo/RC1206JR-07100RL/311-100ERCT-ND/732153; Temperature: -55...+125°C; TypeResistor: Resistor
U2 = LF253: ValueManufacturerPartNumber: LF253, SOIC-8; Package: SOIC-8; PartNumber: LF253
U3 = MC33202: ValueManufacturerPartNumber: MC33202, SOIC-8; Package: SOIC-8; PartNumber: MC33202

## Sheet Relay.SchDoc
size A4; Organization: Altium Limited; Address1: L3, 12a Rodborough Rd; Address2: Frenchs Forest; Address3: NSW; Address4: Australia 2086
Used 18 times, as channels RELAY1, RELAY2, RELAY3, RELAY4, RELAY5, RELAY6, RELAY7, RELAY8, RELAY9, RELAY10, RELAY11, RELAY12, RELAY13, RELAY14, RELAY15, RELAY16, RELAY17, RELAY18. Parts and nets are listed once, with the designators drawn on the sheet.
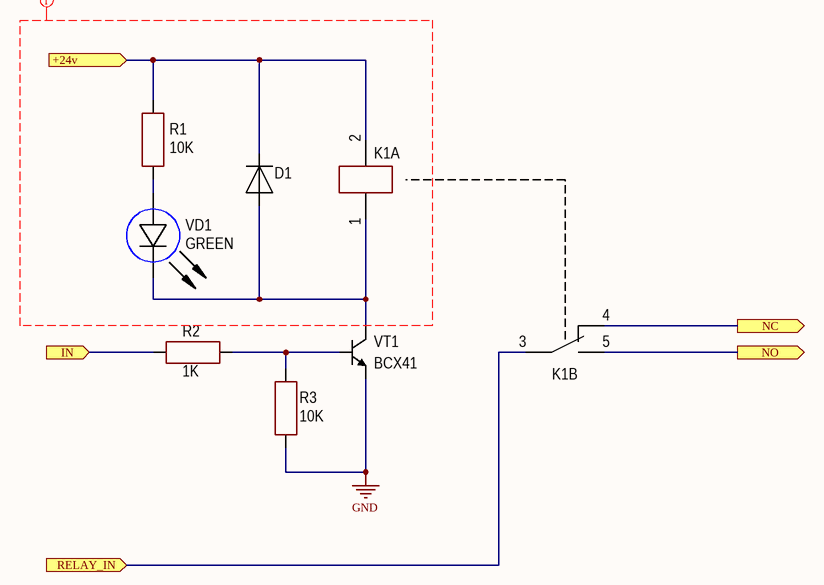
[diagram p5: Relay.SchDoc]

### Parts
D1  (no value)  [DIODE: SMA]
K1  (no value)  [REL: TRJ]  (parts A,B of 2)
R1  value 10K  [RES: 1206]
R2  value 1K  [RES: 1206]
R3  value 10K  [RES: 1206]
VD1  Color: GREEN  [LED: 1206G]
VT1  PartNumber: BCX41  [SOT23]

### Ports
+24v (in), IN (in), NC (out), NO (out), RELAY_IN (in)

### Nets
GND: R3.2 VT1.2(E)
+24v: D1.2 K1.2 R1.1 ; port +24v
IN: R2.1 ; port IN
NC: K1.4 ; port NC
NO: K1.5 ; port NO
RELAY_IN: K1.3 ; port RELAY_IN
NetD1_1: D1.1 K1.1 VD1.2(C) VT1.3(C)
NetR1_2: R1.2 VD1.1(A)
NetR2_2: R2.2 R3.1 VT1.1(B)

### Channels
RELAY1: designators end in _RELAY1; ports +24v=+24v IN=IN1 NC=NC1 NO=NO1 RELAY_IN=RELAY_IN1
RELAY2: designators end in _RELAY2; ports +24v=+24v IN=IN2 NC=NC2 NO=NO2 RELAY_IN=RELAY_IN1
RELAY3: designators end in _RELAY3; ports +24v=+24v IN=IN3 NC=NC3 NO=NO3 RELAY_IN=RELAY_IN1
RELAY4: designators end in _RELAY4; ports +24v=+24v IN=IN4 NC=NC4 NO=NO4 RELAY_IN=RELAY_IN1
RELAY5: designators end in _RELAY5; ports +24v=+24v IN=IN5 NC=NC5 NO=NO5 RELAY_IN=RELAY_IN1
RELAY6: designators end in _RELAY6; ports +24v=+24v IN=IN6 NC=NC6 NO=NO6 RELAY_IN=RELAY_IN1
RELAY7: designators end in _RELAY7; ports +24v=+24v IN=IN7 NC=NC7 NO=NO7 RELAY_IN=RELAY_IN1
RELAY8: designators end in _RELAY8; ports +24v=+24v IN=IN8 NC=NC8 NO=NO8 RELAY_IN=RELAY_IN1
RELAY9: designators end in _RELAY9; ports +24v=+24v IN=IN9 NC=NC9 NO=NO9 RELAY_IN=RELAY_IN10
RELAY10: designators end in _RELAY10; ports +24v=+24v IN=IN10 NC=NC10 NO=NO10 RELAY_IN=RELAY_IN10
RELAY11: designators end in _RELAY11; ports +24v=+24v IN=IN11 NC=NC11 NO=NO11 RELAY_IN=RELAY_IN10
RELAY12: designators end in _RELAY12; ports +24v=+24v IN=IN12 NC=NC12 NO=NO12 RELAY_IN=RELAY_IN10
RELAY13: designators end in _RELAY13; ports +24v=+24v IN=IN13 NC=NC13 NO=NO13 RELAY_IN=RELAY_IN10
RELAY14: designators end in _RELAY14; ports +24v=+24v IN=IN14 NC=NC14 NO=NO14 RELAY_IN=RELAY_IN10
RELAY15: designators end in _RELAY15; ports +24v=+24v IN=IN15 NC=NC15 NO=NO15 RELAY_IN=RELAY_IN10
RELAY16: designators end in _RELAY16; ports +24v=+24v IN=IN16 NC=NC16 NO=NO16 RELAY_IN=RELAY_IN10
RELAY17: designators end in _RELAY17; ports +24v=+24v IN=add_out1 NC=NetK1_RELAY17_4 NO=NetK1_RELAY17_5 RELAY_IN=NetK1_RELAY17_3
RELAY18: designators end in _RELAY18; ports +24v=+24v IN=add_out2 NC=NetK1_RELAY18_4 NO=NetK1_RELAY18_5 RELAY_IN=NetK1_RELAY18_3

### Layout directives
net class Hi_Voltage: (no net found under the mark)

### Notes on the sheet
- Title
- Size:
- Date:
- A4
- Number:
- Time:
- Revision:
- Sheet
- of
- File:

### Library data of the parts
D1 = Diode_single: Manufacturer: Micro Commercial; ValueManufacturerPartNumber: RS1M, SMA; PartNumber: RS1M; TypeDiode: Single diode; Voltage: 1000V; Current: 1A; VoltageDrop: 1V; RecoveryTime: 4ns; Package: SMA; HelpURL: https://www.digikey.com/product-detail/en/micro-commercial-co/1N4148WX-TP/1N4148WXTPMSCT-ND/717312; Temperature: -55...+150°C
K1 = Relay_NT73: Manufacturer: Ningbo Songle; ValueManufacturerPartNumber: Electromechanics relay, 3VDC, 250VAC, 10A, 1NO, -40...+85°C; PartNumber: TRJ-24VDC-SA-CD-R; TypeRelay: Electromechanics relay; VoltageMax: 250VAC; VoltageControlCoil: 3VDC; MaxCurrent: 10A; Package: 1NO; HelpURL: https://lcsc.com/product-detail/Relays_SRD-03VDC-SL-C_C24585.html; Temperature: -40...+85°C
R1 R3 = Resistor_1206: as R14 on sheet Microcontroller; Package: 1206; HelpURL: https://www.digikey.com/product-detail/en/yageo/RC1206JR-07100RL/311-100ERCT-ND/732153; Temperature: -55...+125°C
R2 = Resistor_1206: as R9 on sheet Microcontroller; Package: 1206; HelpURL: https://www.digikey.com/product-detail/en/yageo/RC1206JR-07100RL/311-100ERCT-ND/732153; Temperature: -55...+125°C
VD1 = LED_single: as VD2 on sheet Microcontroller; Manufacturer: *; Package: *; HelpURL: *; Temperature: -55...+150°C; Current: *; VoltageDrop: *; PartNumber: *; ColorParameter: Green
VT1 = BJT_NPN_132: Manufacturer: ON Semiconductor; ValueManufacturerPartNumber: NPN transistor, 45V, 100mA, 100MHz, 300mW, 0.6V, 420, SOT-23, -55...+125°C; TypeTransistor: NPN transistor; VoltageCE: 45V; CurrentCE: 100mA; VoltageSaturation: 0.6V; Frequency: 100MHz; CurrentGain: 420; MaxPower: 300mW; Package: SOT-23; HelpURL: https://www.digikey.com/product-detail/en/on-semiconductor/BC847CLT1G/BC847CLT1GOSCT-ND/917836; Temperature: -55...+125°C

## Nets that join several sheets
+3.3v: Microcontroller (19 pins), PowerSupply (C19.2 D9.2 D9.4 VD7.1), OpAmp (C25.2 U3.8)
+3V3REF: Microcontroller (C3.2 U1.9), PowerSupply (7 pins)
+15v: Main (D3.2 R6.1 X3.2), PowerSupply (6 pins), OpAmp (C23.2 D10.2 D11.2 U2.8)
+24v: Main (D5.2 R8.1), PowerSupply (VD5.1), RELAY1 (D1_RELAY1.2 K1_RELAY1.2 R1_RELAY1.1), RELAY2 (D1_RELAY2.2 K1_RELAY2.2 R1_RELAY2.1), RELAY3 (D1_RELAY3.2 K1_RELAY3.2 R1_RELAY3.1), RELAY4 (D1_RELAY4.2 K1_RELAY4.2 R1_RELAY4.1), RELAY5 (D1_RELAY5.2 K1_RELAY5.2 R1_RELAY5.1), RELAY6 (D1_RELAY6.2 K1_RELAY6.2 R1_RELAY6.1), RELAY7 (D1_RELAY7.2 K1_RELAY7.2 R1_RELAY7.1), RELAY8 (D1_RELAY8.2 K1_RELAY8.2 R1_RELAY8.1), RELAY9 (D1_RELAY9.2 K1_RELAY9.2 R1_RELAY9.1), RELAY10 (D1_RELAY10.2 K1_RELAY10.2 R1_RELAY10.1), RELAY11 (D1_RELAY11.2 K1_RELAY11.2 R1_RELAY11.1), RELAY12 (D1_RELAY12.2 K1_RELAY12.2 R1_RELAY12.1), RELAY13 (D1_RELAY13.2 K1_RELAY13.2 R1_RELAY13.1), RELAY14 (D1_RELAY14.2 K1_RELAY14.2 R1_RELAY14.1), RELAY15 (D1_RELAY15.2 K1_RELAY15.2 R1_RELAY15.1), RELAY16 (D1_RELAY16.2 K1_RELAY16.2 R1_RELAY16.1), RELAY17 (D1_RELAY17.2 K1_RELAY17.2 R1_RELAY17.1), RELAY18 (D1_RELAY18.2 K1_RELAY18.2 R1_RELAY18.1)
-15v: Main (D4.1 R7.1 X3.1), PowerSupply (C20.2 C21.1 R31.2), OpAmp (C24.2 D10.1 D11.1 U2.4)
GND: Main (6 pins), Microcontroller (26 pins), USB_mini (D8.2 R23.1 X13.4 X13.5), PowerSupply (16 pins), OpAmp (10 pins), RELAY1 (R3_RELAY1.2 VT1_RELAY1.2), RELAY2 (R3_RELAY2.2 VT1_RELAY2.2), RELAY3 (R3_RELAY3.2 VT1_RELAY3.2), RELAY4 (R3_RELAY4.2 VT1_RELAY4.2), RELAY5 (R3_RELAY5.2 VT1_RELAY5.2), RELAY6 (R3_RELAY6.2 VT1_RELAY6.2), RELAY7 (R3_RELAY7.2 VT1_RELAY7.2), RELAY8 (R3_RELAY8.2 VT1_RELAY8.2), RELAY9 (R3_RELAY9.2 VT1_RELAY9.2), RELAY10 (R3_RELAY10.2 VT1_RELAY10.2), RELAY11 (R3_RELAY11.2 VT1_RELAY11.2), RELAY12 (R3_RELAY12.2 VT1_RELAY12.2), RELAY13 (R3_RELAY13.2 VT1_RELAY13.2), RELAY14 (R3_RELAY14.2 VT1_RELAY14.2), RELAY15 (R3_RELAY15.2 VT1_RELAY15.2), RELAY16 (R3_RELAY16.2 VT1_RELAY16.2), RELAY17 (R3_RELAY17.2 VT1_RELAY17.2), RELAY18 (R3_RELAY18.2 VT1_RELAY18.2)
add_out1: Microcontroller (U1.43), RELAY17 (R2_RELAY17.1)
add_out2: Microcontroller (U1.38), RELAY18 (R2_RELAY18.1)
IN1: Microcontroller (U1.12), RELAY1 (R2_RELAY1.1)
IN2: Microcontroller (U1.13), RELAY2 (R2_RELAY2.1)
IN3: Microcontroller (U1.14), RELAY3 (R2_RELAY3.1)
IN4: Microcontroller (U1.42), RELAY4 (R2_RELAY4.1)
IN5: Microcontroller (U1.41), RELAY5 (R2_RELAY5.1)
IN6: Microcontroller (U1.40), RELAY6 (R2_RELAY6.1)
IN7: Microcontroller (U1.18), RELAY7 (R2_RELAY7.1)
IN8: Microcontroller (U1.19), RELAY8 (R2_RELAY8.1)
IN9: Microcontroller (U1.20), RELAY9 (R2_RELAY9.1)
IN10: Microcontroller (U1.21), RELAY10 (R2_RELAY10.1)
IN11: Microcontroller (U1.22), RELAY11 (R2_RELAY11.1)
IN12: Microcontroller (U1.25), RELAY12 (R2_RELAY12.1)
IN13: Microcontroller (U1.26), RELAY13 (R2_RELAY13.1)
IN14: Microcontroller (U1.27), RELAY14 (R2_RELAY14.1)
IN15: Microcontroller (U1.28), RELAY15 (R2_RELAY15.1)
IN16: Microcontroller (U1.29), RELAY16 (R2_RELAY16.1)
NetD2_1: Main (D2.1 R5.1), OpAmp (R32.2 R34.2)
NetD2_2: Main (D2.2 R4.1), OpAmp (R34.1 R36.1)
NetK1_RELAY17_3: Main (X6.2), RELAY17 (K1_RELAY17.3)
NetK1_RELAY17_4: Main (X6.3), RELAY17 (K1_RELAY17.4)
NetK1_RELAY17_5: Main (X6.1), RELAY17 (K1_RELAY17.5)
NetK1_RELAY18_3: Main (X8.2), RELAY18 (K1_RELAY18.3)
NetK1_RELAY18_4: Main (X8.3), RELAY18 (K1_RELAY18.4)
NetK1_RELAY18_5: Main (X8.1), RELAY18 (K1_RELAY18.5)
NetR18_2: Microcontroller (R18.2), OpAmp (R42.2 U3.6 U3.7)
NetR19_2: Microcontroller (R19.2), OpAmp (R38.2 U3.1 U3.2)
NetR41_1: Main (X3.3), OpAmp (R41.1)
NO1: Main (X2.1), RELAY1 (K1_RELAY1.5)
NO2: Main (X2.2), RELAY2 (K1_RELAY2.5)
NO3: Main (X2.3), RELAY3 (K1_RELAY3.5)
NO4: Main (X2.4), RELAY4 (K1_RELAY4.5)
NO5: Main (X2.7), RELAY5 (K1_RELAY5.5)
NO6: Main (X2.8), RELAY6 (K1_RELAY6.5)
NO7: Main (X2.9), RELAY7 (K1_RELAY7.5)
NO8: Main (X2.10), RELAY8 (K1_RELAY8.5)
NO9: Main (X4.10), RELAY9 (K1_RELAY9.5)
NO10: Main (X4.9), RELAY10 (K1_RELAY10.5)
NO11: Main (X4.8), RELAY11 (K1_RELAY11.5)
NO12: Main (X4.7), RELAY12 (K1_RELAY12.5)
NO13: Main (X4.4), RELAY13 (K1_RELAY13.5)
NO14: Main (X4.3), RELAY14 (K1_RELAY14.5)
NO15: Main (X4.2), RELAY15 (K1_RELAY15.5)
NO16: Main (X4.1), RELAY16 (K1_RELAY16.5)
RELAY_IN1: Main (X2.5 X2.6), RELAY1 (K1_RELAY1.3), RELAY2 (K1_RELAY2.3), RELAY3 (K1_RELAY3.3), RELAY4 (K1_RELAY4.3), RELAY5 (K1_RELAY5.3), RELAY6 (K1_RELAY6.3), RELAY7 (K1_RELAY7.3), RELAY8 (K1_RELAY8.3)
RELAY_IN10: Main (X4.5 X4.6), RELAY9 (K1_RELAY9.3), RELAY10 (K1_RELAY10.3), RELAY11 (K1_RELAY11.3), RELAY12 (K1_RELAY12.3), RELAY13 (K1_RELAY13.3), RELAY14 (K1_RELAY14.3), RELAY15 (K1_RELAY15.3), RELAY16 (K1_RELAY16.3)
USB_D+: Microcontroller (U1.33), USB_mini (R20.2 R22.2)
USB_D-: Microcontroller (U1.32), USB_mini (R21.2)